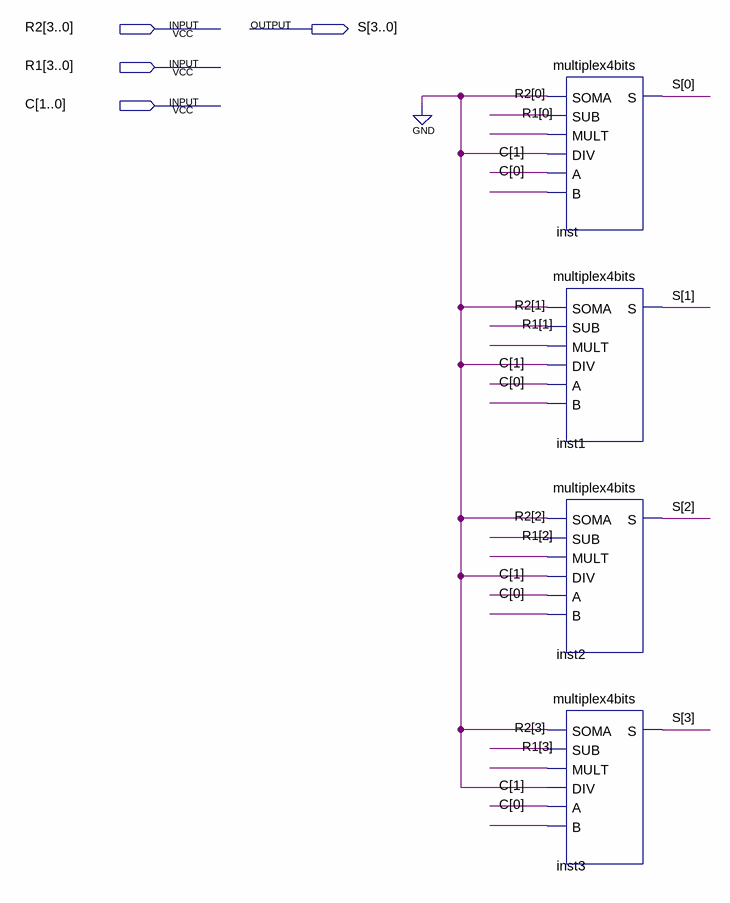
[diagram p0: schematic sheet]
// Quartus schematic mux8bits.bdf as structural Verilog: 4 symbols, 4 pins
module mux8bits (
  input  [3:0] R2,
  input  [3:0] R1,
  input  [1:0] C,
  output [3:0] S
);

  multiplex4bits inst (.SOMA(1'b0), .SUB(R2[0]), .MULT(R1[0]), .DIV(1'b0), .A(C[1]), .B(C[0]), .S(S[0]));
  multiplex4bits inst1 (.SOMA(1'b0), .SUB(R2[1]), .MULT(R1[1]), .DIV(1'b0), .A(C[1]), .B(C[0]), .S(S[1]));
  multiplex4bits inst2 (.SOMA(1'b0), .SUB(R2[2]), .MULT(R1[2]), .DIV(1'b0), .A(C[1]), .B(C[0]), .S(S[2]));
  multiplex4bits inst3 (.SOMA(1'b0), .SUB(R2[3]), .MULT(R1[3]), .DIV(1'b0), .A(C[1]), .B(C[0]), .S(S[3]));
endmodule
